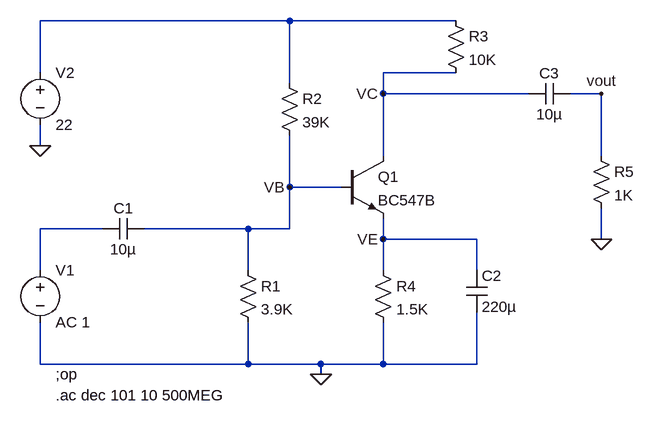
[diagram p0: schematic Transistor Amplifier.asc]
Transistor Amplifier.asc, the LTspice schematic file:
Version 4
SHEET 1 880 680
WIRE 240 -48 -144 -48
WIRE 496 -48 240 -48
WIRE -144 32 -144 -48
WIRE 496 32 384 32
WIRE 240 48 240 -48
WIRE 384 64 384 32
WIRE 608 64 384 64
WIRE 720 64 672 64
WIRE -144 144 -144 112
WIRE 384 160 384 64
WIRE 720 160 720 64
WIRE 240 208 240 128
WIRE 320 208 240 208
WIRE -48 272 -144 272
WIRE 176 272 16 272
WIRE 240 272 240 208
WIRE 240 272 176 272
WIRE 384 288 384 256
WIRE 528 288 384 288
WIRE 720 288 720 240
WIRE -144 336 -144 272
WIRE 176 336 176 272
WIRE 384 336 384 288
WIRE 528 336 528 288
WIRE -144 480 -144 416
WIRE 176 480 176 416
WIRE 176 480 -144 480
WIRE 288 480 176 480
WIRE 384 480 384 416
WIRE 384 480 288 480
WIRE 528 480 528 400
WIRE 528 480 384 480
WIRE 288 496 288 480
FLAG 720 288 0
FLAG -144 144 0
FLAG 288 496 0
FLAG 720 64 vout
FLAG 384 64 VC
FLAG 384 288 VE
FLAG 240 208 VB
SYMBOL voltage -144 320 R0
SYMATTR InstName V1
SYMATTR Value AC 1
SYMATTR Value2 AC 1
SYMBOL voltage -144 16 R0
SYMATTR InstName V2
SYMATTR Value 22
SYMBOL cap 16 256 R90
WINDOW 0 0 32 VBottom 2
WINDOW 3 32 32 VTop 2
SYMATTR InstName C1
SYMATTR Value 10µ
SYMBOL cap 512 336 R0
SYMATTR InstName C2
SYMATTR Value 220µ
SYMBOL cap 672 48 R90
WINDOW 0 0 32 VBottom 2
WINDOW 3 32 32 VTop 2
SYMATTR InstName C3
SYMATTR Value 10µ
SYMBOL res 160 320 R0
SYMATTR InstName R1
SYMATTR Value 3.9K
SYMBOL res 224 32 R0
SYMATTR InstName R2
SYMATTR Value 39K
SYMBOL res 480 -64 R0
SYMATTR InstName R3
SYMATTR Value 10K
SYMBOL res 368 320 R0
SYMATTR InstName R4
SYMATTR Value 1.5K
SYMBOL res 704 144 R0
SYMATTR InstName R5
SYMATTR Value 1K
SYMBOL npn 320 160 R0
SYMATTR InstName Q1
SYMATTR Value BC547B
TEXT -120 496 Left 2 !;op
TEXT -120 528 Left 2 !.ac dec 101 10 500MEG

The netlist it stands for:
* Transistor Amplifier.asc
V1 N002 0 AC 1 AC 1
V2 N001 0 22
C1 VB N002 10µ
C2 VE 0 220µ
C3 vout VC 10µ
R1 VB 0 3.9K
R2 N001 VB 39K
R3 N001 VC 10K
R4 VE 0 1.5K
R5 vout 0 1K
Q1 VC VB VE 0 BC547B
.model NPN NPN
.model PNP PNP
.lib standard.bjt
;op
.ac dec 101 10 500MEG
.backanno
.end